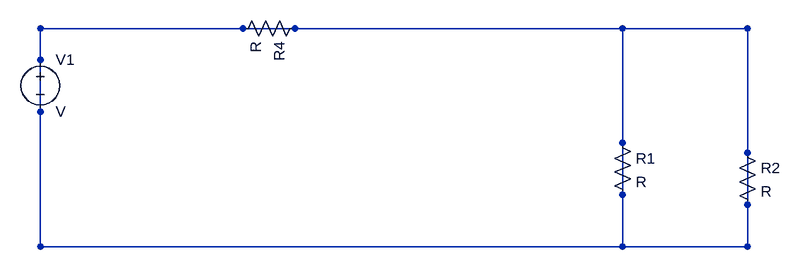
[diagram p0: schematic C137_D2_P4.jpg.asc]
C137_D2_P4.jpg.asc, the LTspice schematic file:
Version 4
SHEET 1 880 680
SYMBOL res 1296 640 R0
SYMATTR InstName R1
SYMBOL res 1488 655 R0
SYMATTR InstName R2
SYMBOL res 824 464 R90
SYMATTR InstName R3
SYMATTR InstName R4
SYMBOL voltage 416 512 R0
SYMATTR InstName V1
WIRE 416 480 416 816
WIRE 416 480 1504 480
WIRE 416 480 1312 480
WIRE 416 816 1504 816
WIRE 1504 480 1504 816
WIRE 1312 816 1504 816
WIRE 416 816 1312 816
WIRE 1312 480 1504 480
WIRE 1312 480 1312 816

The netlist it stands for:
* C137_D2_P4.jpg.asc
R1 N001 N001 R
R2 N001 N001 R
R4 N001 N001 R
V1 N001 N001 V
.backanno
.end